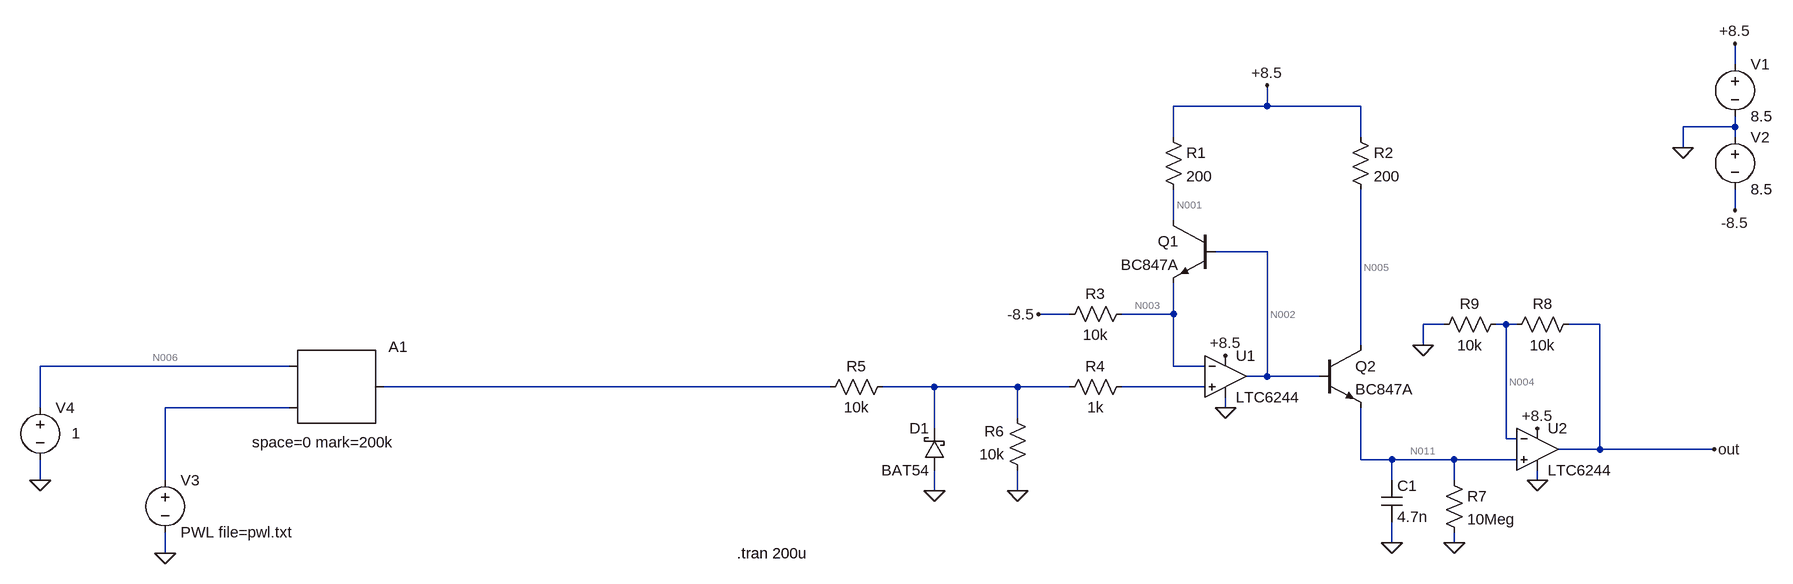
[diagram p0: schematic peak_detector.asc]
peak_detector.asc, the LTspice schematic file:
Version 4
SHEET 1 944 680
WIRE 880 -320 880 -352
WIRE 160 -256 160 -288
WIRE 160 -256 16 -256
WIRE 304 -256 160 -256
WIRE 880 -224 880 -240
WIRE 880 -224 800 -224
WIRE 16 -208 16 -256
WIRE 304 -208 304 -256
WIRE 880 -208 880 -224
WIRE 800 -192 800 -224
WIRE 880 -96 880 -128
WIRE 16 -80 16 -128
WIRE 160 -32 80 -32
WIRE -144 64 -192 64
WIRE 16 64 16 16
WIRE 16 64 -64 64
WIRE 432 80 400 80
WIRE 528 80 512 80
WIRE 544 80 528 80
WIRE 672 80 624 80
WIRE 304 112 304 -128
WIRE 400 112 400 80
WIRE -1344 144 -1728 144
WIRE 16 144 16 64
WIRE 64 144 16 144
WIRE 160 160 160 -32
WIRE 160 160 128 160
WIRE 240 160 160 160
WIRE -512 176 -1200 176
WIRE -352 176 -432 176
WIRE -224 176 -352 176
WIRE -144 176 -224 176
WIRE 64 176 -64 176
WIRE -1728 208 -1728 144
WIRE -1344 208 -1536 208
WIRE 96 208 96 192
WIRE -224 224 -224 176
WIRE -352 240 -352 176
WIRE 528 256 528 80
WIRE 544 256 528 256
WIRE 672 272 672 80
WIRE 672 272 608 272
WIRE 848 272 672 272
WIRE 304 288 304 208
WIRE 352 288 304 288
WIRE 448 288 352 288
WIRE 544 288 448 288
WIRE -1728 320 -1728 288
WIRE -1536 320 -1536 208
WIRE 352 320 352 288
WIRE 448 320 448 288
WIRE 576 320 576 304
WIRE -352 336 -352 304
WIRE -224 336 -224 304
WIRE 352 416 352 384
WIRE 448 416 448 400
WIRE -1536 432 -1536 400
FLAG 96 128 +8.5
FLAG 96 208 0
FLAG 576 320 0
FLAG 448 416 0
FLAG 352 416 0
FLAG 400 112 0
FLAG -224 336 0
FLAG -352 336 0
FLAG 576 240 +8.5
FLAG 160 -288 +8.5
FLAG -192 64 -8.5
FLAG 800 -192 0
FLAG 880 -352 +8.5
FLAG 880 -96 -8.5
FLAG 848 272 out
FLAG -1536 432 0
FLAG -1728 320 0
SYMBOL Opamps\\LTC6244 96 160 R0
SYMATTR InstName U1
SYMBOL Opamps\\LTC6244 576 272 R0
SYMATTR InstName U2
SYMBOL npn 80 -80 M0
SYMATTR InstName Q1
SYMATTR Value BC847A
SYMBOL npn 240 112 R0
SYMATTR InstName Q2
SYMATTR Value BC847A
SYMBOL res 0 -224 R0
SYMATTR InstName R1
SYMATTR Value 200
SYMBOL res 288 -224 R0
SYMATTR InstName R2
SYMATTR Value 200
SYMBOL res -48 48 R90
WINDOW 0 0 56 VBottom 2
WINDOW 3 32 56 VTop 2
SYMATTR InstName R3
SYMATTR Value 10k
SYMBOL res -48 160 R90
WINDOW 0 0 56 VBottom 2
WINDOW 3 32 56 VTop 2
SYMATTR InstName R4
SYMATTR Value 1k
SYMBOL res -416 160 R90
WINDOW 0 0 56 VBottom 2
WINDOW 3 32 56 VTop 2
SYMATTR InstName R5
SYMATTR Value 10k
SYMBOL res -208 320 R180
WINDOW 0 36 76 Left 2
WINDOW 3 36 40 Left 2
SYMATTR InstName R6
SYMATTR Value 10k
SYMBOL res 432 304 R0
SYMATTR InstName R7
SYMATTR Value 10Meg
SYMBOL res 640 64 R90
WINDOW 0 0 56 VBottom 2
WINDOW 3 32 56 VTop 2
SYMATTR InstName R8
SYMATTR Value 10k
SYMBOL res 528 64 R90
WINDOW 0 0 56 VBottom 2
WINDOW 3 32 56 VTop 2
SYMATTR InstName R9
SYMATTR Value 10k
SYMBOL schottky -336 304 R180
WINDOW 0 24 64 Left 2
WINDOW 3 24 0 Left 2
SYMATTR InstName D1
SYMATTR Value BAT54
SYMBOL cap 336 320 R0
SYMATTR InstName C1
SYMATTR Value 4.7n
SYMBOL voltage 880 -336 R0
WINDOW 123 0 0 Left 2
WINDOW 39 0 0 Left 2
SYMATTR InstName V1
SYMATTR Value 8.5
SYMBOL voltage 880 -224 R0
WINDOW 123 0 0 Left 2
WINDOW 39 0 0 Left 2
SYMATTR InstName V2
SYMATTR Value 8.5
SYMBOL SpecialFunctions\\modulate -1344 144 R0
WINDOW 3 -58 117 Left 2
SYMATTR Value space=0 mark=200k
SYMATTR InstName A1
SYMBOL voltage -1536 304 R0
WINDOW 123 0 0 Left 2
WINDOW 39 0 0 Left 2
SYMATTR InstName V3
SYMATTR Value PWL file=pwl.txt
SYMBOL voltage -1728 192 R0
WINDOW 123 0 0 Left 2
WINDOW 39 0 0 Left 2
WINDOW 3 48 55 Left 2
SYMATTR InstName V4
SYMATTR Value 1
TEXT -656 432 Left 2 !.tran 200u

The netlist it stands for:
* peak_detector.asc
XU1 N009 N003 +8.5 0 N002 LTC6244  ; pins In+ In- V+ V- OUT
XU2 N011 N004 +8.5 0 out LTC6244  ; pins In+ In- V+ V- OUT
Q1 N001 N002 N003 0 BC847A
Q2 N005 N002 N011 0 BC847A
R1 +8.5 N001 200
R2 +8.5 N005 200
R3 N003 -8.5 10k
R4 N009 N008 1k
R5 N008 N007 10k
R6 0 N008 10k
R7 N011 0 10Meg
R8 out N004 10k
R9 N004 0 10k
D1 0 N008 BAT54
C1 N011 0 4.7n
V1 +8.5 0 8.5
V2 0 -8.5 8.5
A1 N006 N010 0 0 0 0 N007 0 MODULATOR space=0 mark=200k
V3 N010 0 PWL file=pwl.txt
V4 N006 0 1
.model D D
.lib standard.dio
.model NPN NPN
.model PNP PNP
.lib standard.bjt
.tran 200u
.backanno
.end

* Results of the author's LTspice run, read from the files saved beside the schematic
* Operating Point, zero values left out:
*   V(n003) = 638.2 µV
*   V(+8.5) = 8.5 V
*   V(n002) = 647.2 mV
*   V(n004) = 267.7 mV
*   V(n011) = 267.7 mV
*   V(out) = 535.5 mV
*   V(n001) = 8.331 V
*   V(n005) = 8.5 V
*   V(-8.5) = -8.5 V
*   V(n006) = 1 V
*   Ic(Q2) = 26.64 nA
*   Ib(Q2) = 135.9 pA
*   Ie(Q2) = -26.77 nA
*   Ic(Q1) = 845.5 µA
*   Ib(Q1) = 4.524 µA
*   Ie(Q1) = -850.1 µA
*   I(R9) = 26.77 µA
*   I(R8) = 26.77 µA
*   I(R7) = 26.77 nA
*   I(R3) = 850.1 µA
*   I(R2) = 26.64 nA
*   I(R1) = 845.5 µA
*   I(V2) = -850.1 µA
*   I(V1) = -11.01 mA
*   Ix(u1:3) = 5.269 mA
*   Ix(u1:4) = -5.264 mA
*   Ix(u1:5) = -4.524 µA
*   Ix(u2:3) = 4.898 mA
*   Ix(u2:4) = -4.871 mA
*   Ix(u2:5) = -26.77 µA
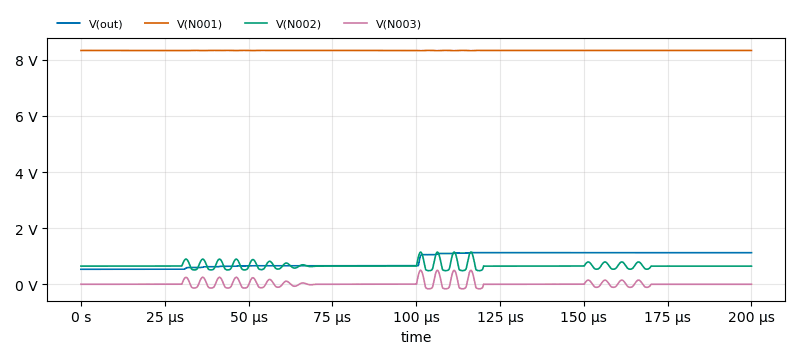
[diagram p1: Transient Analysis of peak_detector.asc, plotted from the saved traces]
* Transient Analysis, 1 run:
*   V(out): min 535.5 mV, max 1.131 V, average 865.3 mV, rms 902.3 mV, last 1.126 V
*   V(N001): min 8.321 V, max 8.334 V, average 8.331 V, rms 8.331 V, last 8.331 V
*   V(N002): min 485.2 mV, max 1.147 V, average 661.8 mV, rms 670 mV, last 647.2 mV
*   V(N003): min -160.9 mV, max 498.3 mV, average 15.21 mV, rms 104.8 mV, last 638.2 µV